# EAGLE design dome-board3 (EAGLE 7.2.0)
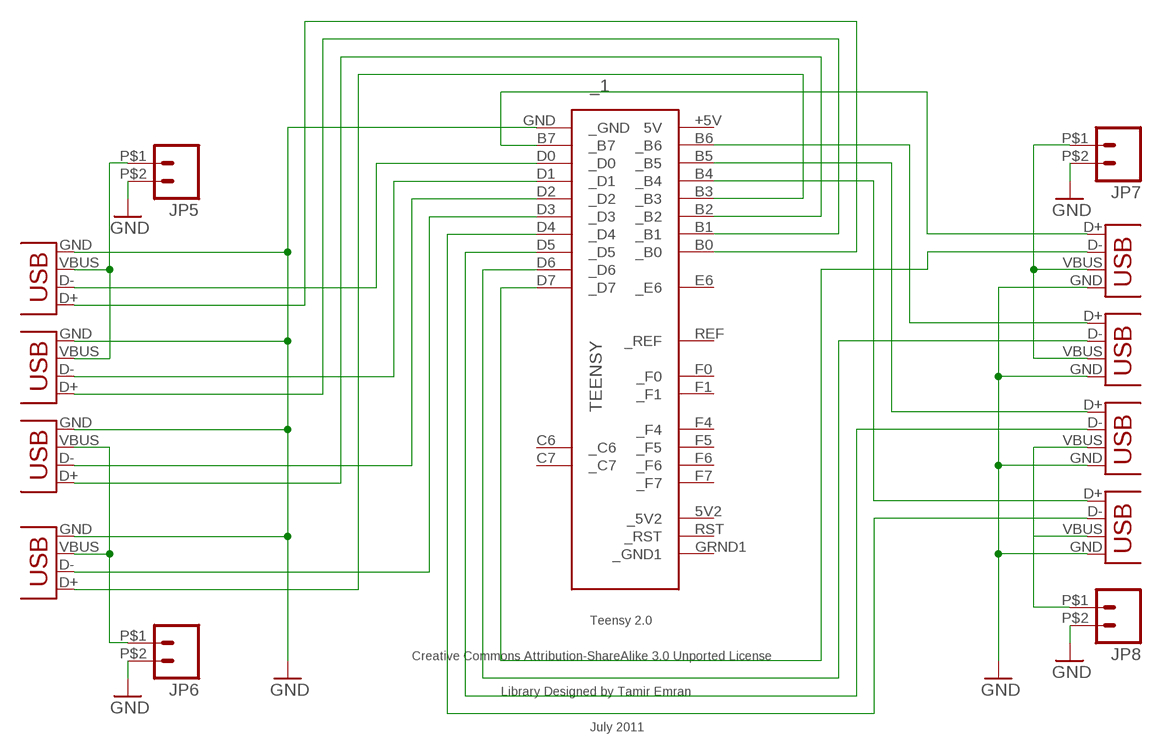
[diagram p0: schematic, sheet 1]

## Parts
_1  TEENSY  [TEENSY]
JP5  M026.35MM  [SCREWTERMINAL-6.35MM-2]
JP6  M026.35MM  [SCREWTERMINAL-6.35MM-2]
JP7  M026.35MM  [SCREWTERMINAL-6.35MM-2]
JP8  M026.35MM  [SCREWTERMINAL-6.35MM-2]
USB1  USB  [USBA]
USB2  USB  [USBA]
USB3  USB  [USBA]
USB4  USB  [USBA]
USB5  USB  [USBA]
USB6  USB  [USBA]
USB7  USB  [USBA]
USB8  USB  [USBA]

## Nets
GND: _1.GND(_GND) JP5.P$2 JP6.P$2 JP7.P$2 JP8.P$2 USB1.GND USB2.GND USB3.GND USB4.GND USB5.GND USB6.GND USB7.GND USB8.GND
N$1: _1.B0(_B0) USB1.D+
N$2: _1.B1(_B1) USB2.D+
N$3: _1.B2(_B2) USB3.D+
N$4: _1.B3(_B3) USB4.D+
N$5: _1.B4(_B4) USB5.D+
N$6: _1.B5(_B5) USB6.D+
N$7: _1.B6(_B6) USB7.D+
N$9: _1.D0(_D0) USB1.D-
N$10: _1.D1(_D1) USB2.D-
N$11: _1.D2(_D2) USB3.D-
N$12: _1.D3(_D3) USB4.D-
N$13: _1.D4(_D4) USB5.D-
N$14: _1.D5(_D5) USB6.D-
N$15: _1.D6(_D6) USB7.D-
N$16: _1.D7(_D7) USB8.D-
N$20: _1.B7(_B7) USB8.D+
VCC1: JP5.P$1 USB1.VBUS USB2.VBUS
VCC2: JP7.P$1 USB7.VBUS USB8.VBUS
VCC3: JP6.P$1 USB3.VBUS USB4.VBUS
VCC4: JP8.P$1 USB5.VBUS USB6.VBUS
Unconnected: _1.5V2(_5V2) _1.+5V(5V) _1.C6(_C6) _1.C7(_C7) _1.E6(_E6) _1.F0(_F0) _1.F1(_F1) _1.F4(_F4) _1.F5(_F5) _1.F6(_F6) _1.F7(_F7) _1.GRND1(_GND1) _1.REF(_REF) _1.RST(_RST)

## Library data of the parts
_1 = teensy:TEENSY: Teensy 2.0 Original Design by Clint Fisher Modified Design by Tamir Emran Licensed Under Creative Commons Attribution-ShareAlike 3.0 Unported (CC BY-SA 3.0)
JP5-JP8 = SparkFun:M02: Header 2 Standard 2-pin 0.1" header. Use with straight break away headers (SKU : PRT-00116), right angle break away headers (PRT-00553), swiss pins (PRT-00743), machine pins (PRT-00117), and female headers (PRT-00115). Molex polarized connector foot print use with SKU : PRT-08233 with associated crimp pins and housings.
USB1-USB8 = MaxHenstell:USB

## Net classes
0 default: width 0.305 mm, clearance 0.305 mm
1 power: width 3.124 mm, clearance 0.635 mm

## Board
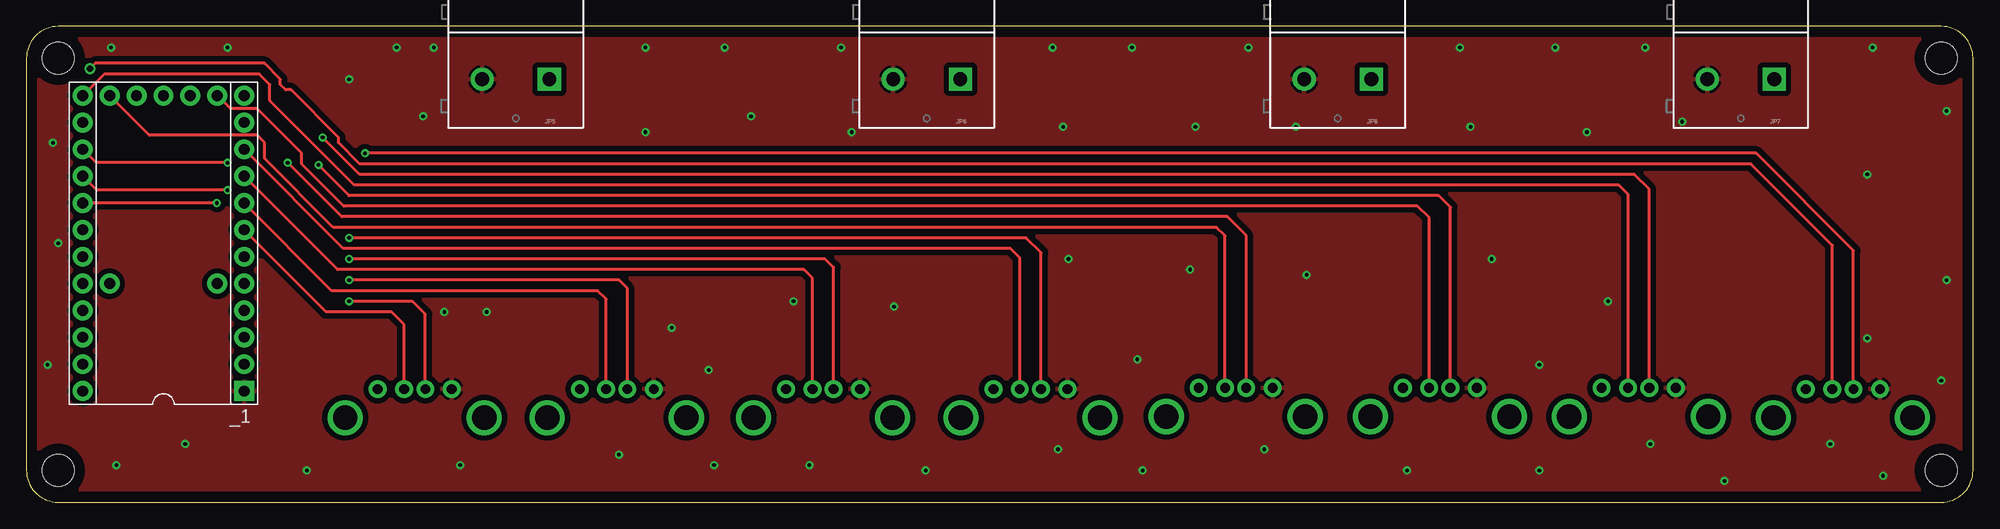
[diagram p1: board, top side]
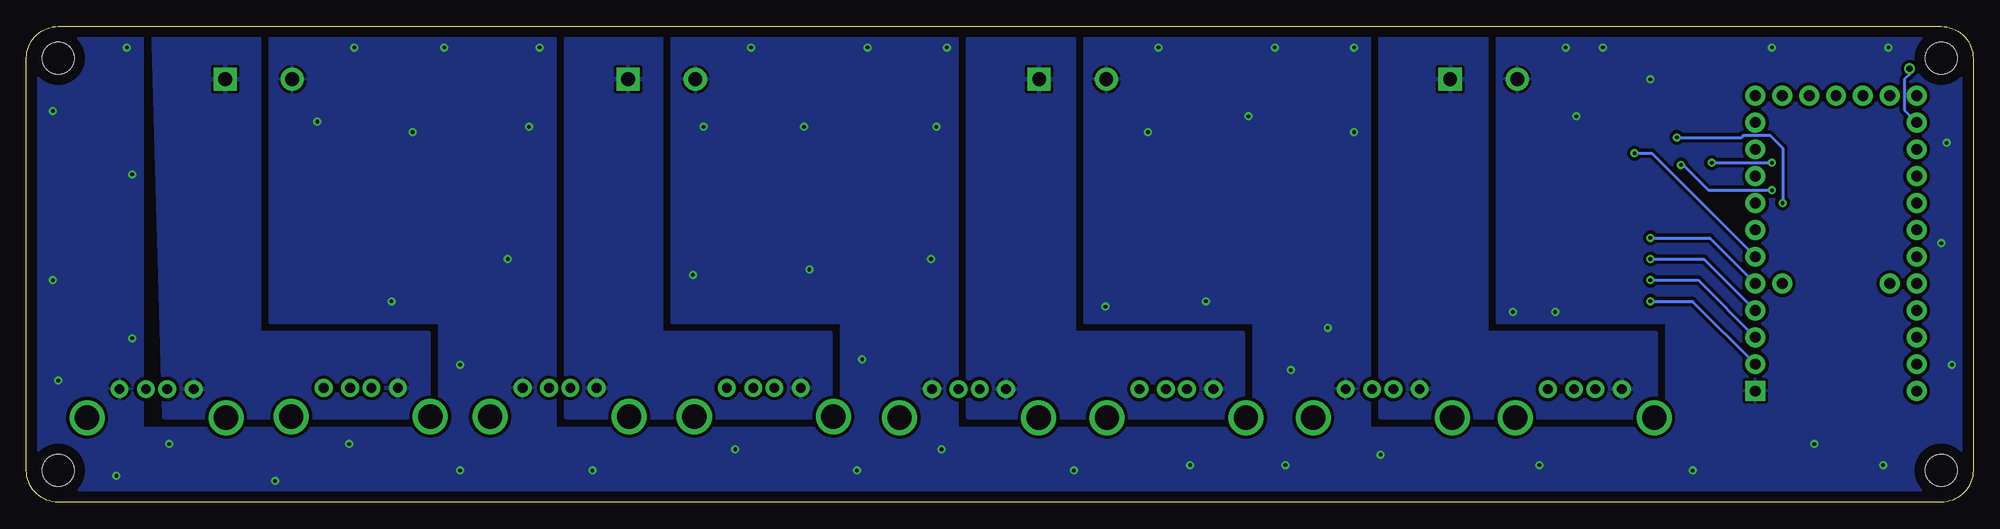
[diagram p2: board, bottom side, seen from below]

Size 184 x 45 mm. Coordinates in mm from the lower left corner, seen from the top.
Outline: 0,42 0,3 arc90 3,0 181,0 arc90 184,3 184,42 arc90 181,45 3,45 arc90 0,42
Copper layers (1*16): Top 0.035mm / dielectric 1.5mm / Bottom 0.035mm
Design rules "default *": minimum track width 8mil, minimum drill 15mil, track to track 8mil, track to pad 8mil, pad to pad 8mil, via to via 8mil, smd to smd 8mil, copper to edge 40mil, drill to drill 10mil, minimum pad ring 10mil, minimum via ring 8mil, stop-mask expansion 4mil, vias tented up to drill 0mil, thermal gap 10mil
Holes 3 mm at 3,3 3,42 181,3 181,42

### Footprints (pad centres in the part's own frame; a part is rotated, then mirrored left to right if it is on the bottom)
TEENSY = drill 1.016 pad 1.88: 5V2 13.97,-2.54; +5V -13.97,7.62; B0 -11.43,-7.62; B1 -8.89,-7.62; B2 -6.35,-7.62; B3 -3.81,-7.62; B4 8.89,7.62; B5 6.35,7.62; B6 3.81,7.62; B7 -1.27,-7.62; C6 11.43,-7.62; C7 13.97,-7.62; D0 1.27,-7.62; D1 3.81,-7.62; D2 6.35,-7.62; D3 8.89,-7.62; D4 13.97,5.08; D5 13.97,-5.08; D6 13.97,7.62; D7 11.43,7.62; E6 -3.81,-5.08; F0 -11.43,7.62; F1 -8.89,7.62; F4 -6.35,7.62; F5 -3.81,7.62; F6 -1.27,7.62; F7 1.27,7.62; GRND1 13.97,0; REF -3.81,5.08; RST 13.97,2.54 | drill 1.016 pad 1.88 square: GND -13.97,-7.62
SCREWTERMINAL-6.35MM-2 = drill 1.3 pad 2.184 square: P$1 -3.175,0 | drill 1.3 pad 2.184: P$2 3.175,0
USBA = drill 0.92 pad 1.676: D+ 0,-1; D- 0,1; GND 0,-3.5; VBUS 0,3.5 | drill 2.3: GND2 -2.71,-6.57; GND3 -2.71,6.57

### Placement (x,y rotation side)
_1  12.95,24.48 90 top
JP5  46.25,40 180 top
JP6  85.1,40 180 top
JP7  162.05,40 180 top
JP8  123.95,40 180 top
USB1  36.7,10.7 90 top
USB2  55.8,10.7 90 top
USB3  75.3,10.7 90 top
USB4  94.9,10.7 90 top
USB5  114.3,10.8 90 top
USB6  133.6,10.8 90 top
USB7  152.4,10.8 90 top
USB8  171.7,10.7 90 top

### Tracks (layer width: path | path; a pad name or v marks a point on that pad's centre or on a via)
GND  (via drill 0.35)
  other vias: 35,43 38.5,43 58.5,43 66,43 77,43 97,43 104.5,43 115.5,43 135.5,43 144.5,43 153,43 174.5,43 181.5,37 174,31 181.5,21 174,15.5 181,11.5 175.5,2.5 170.5,5.5 160.5,2 153.5,5.5 143,3 143,13 149.5,19 138.5,23 130.5,3 121,21.5 117,5 105.5,3 105,13.5 110,22 98.5,23 97.5,5 85,3 82,18.5 72.5,19 61,16.5 64.5,12.5 74,3.5 65,3.5 56,4.5 41,3.5 26.5,3 15,5.5 8.5,3.5 2,13 3,24.5 2.5,34 8,43 19,43 37.5,36.5 30.5,40 58.5,35 68.5,36.5 78,35 43.5,18 39.5,18 98,35.5 110.5,35.5 120,35.5 136.5,35.5 147.5,35 156.5,36
  pour Top (isolate 0.5): -2.3,44.6 186.3,44.3 186.7,0.3 -2.6,0.4 -2.3,44.5
  pour Bottom: 0,45 45,45 45,17 29,17 29,7 57,7 57,45 84,45 84,17 68,17 68,7 96,7 96,45 123,45 123,17 107,17 107,7 134,7 134,45 161,45 161,17 145,17 145,7 173,7 173,45 184,45 184,0 0,0
N$1  (via drill 0.35)
  Top 0.305: USB1.D+ 37.7,17.8 36.5,19 v30.5,19
  Bottom 0.305: v30.5,19 26.52,19 _1.B0
N$2  (via drill 0.35)
  Top 0.305: USB2.D+ 56.8,20.2 56,21 v30.5,21
  Bottom 0.305: v30.5,21 25.98,21 _1.B1
N$3  (via drill 0.35)
  Top 0.305: USB3.D+ 76.3,22.2 75.5,23 v30.5,23
  Bottom 0.305: v30.5,23 25.43,23 _1.B2
N$4  (via drill 0.35)
  Top 0.305: USB4.D+ 95.9,23.6 94.5,25 v30.5,25
  Bottom 0.305: v30.5,25 24.89,25 _1.B3
N$5  (via drill 0.35)
  Top 0.305: USB5.D+ 115.3,25.2 113.5,27 29.8,27 v24.7,32.1 | v19,32.1 6.61,32.1 _1.B4
  Bottom 0.305: v24.7,32.1 v19,32.1
N$6  (via drill 0.35)
  Top 0.305: USB6.D+ 134.6,27.9 133.5,29 30.5,29 v27.6,31.9 | v19,29.5 6.67,29.5 _1.B5
  Bottom 0.305: v27.6,31.9 27.4,31.9 25,29.5 v19,29.5
N$7  (via drill 0.35)
  Top 0.305: USB7.D+ 153.4,29.6 152,31 31.5,31 v28,34.5 | v18,28.3 _1.B6
  Bottom 0.305: v28,34.5 21.9,34.5 21.7,34.7 19.2,34.7 18,33.5 v18,28.3
N$9
  Top 0.305: USB1.D- 35.7,16.8 34.5,18 28.32,18 _1.D0
N$10
  Top 0.305: USB2.D- 54.8,19.2 54,20 28.86,20 _1.D1
N$11
  Top 0.305: USB3.D- 74.3,21.2 73.5,22 29.41,22 _1.D2
N$12
  Top 0.305: USB4.D- 93.9,23.1 93,24 29.95,24 _1.D3
N$13
  Top 0.305: USB5.D- 113.3,25.2 112.5,26 29,26 22.5,32.5 22.5,34 21.8,34.7 11.62,34.7 _1.D4
N$14
  Top 0.305: USB6.D- 132.6,26.9 131.5,28 30,28 26,32 26,33 21.8,37.2 19.29,37.2 _1.D5
N$15
  Top 0.305: USB7.D- 151.4,29.1 150.5,30 31,30 23,38 23,39.5 22,40.5 7.38,40.5 _1.D6
N$16  (via drill 0.6)
  Top 0.305: USB8.D- 170.7,24.3 163,32 31.5,32 29.5,34 29.5,34.5 25,39 24.5,39 24,39.5 24,40 22.5,41.5 6.5,41.5 v6,41
  Bottom 0.305: v6,41 6,40.5 6.5,40 6.5,37.09 _1.D7
N$20  (via drill 0.35)
  Top 0.305: USB8.D+ 172.7,23.8 163.5,33 v32,33
  Bottom 0.305: v32,33 30.36,33 _1.B7
VCC1
  pour Bottom: 46,45 46,16 30,16 30,8 56,8 56,45
VCC2
  pour Bottom: 162,45 172,45 171,8 146,8 146,16 162,16
VCC3
  pour Bottom: 85,45 95,45 95,8 69,8 69,16 85,16
VCC4
  pour Bottom: 133,8 108,8 108,16 124,16 124,45 133,45

### Text on the board
tDocu: 12V 14A | Hack Rock City | .org | Dome Controller 2012 Max Henstell | 1 | 2 | 3 | 4 | 5 | 6 | 7 | 8 | teensy 2.0